# EAGLE schematic lpc176x (EAGLE 7.2.0)
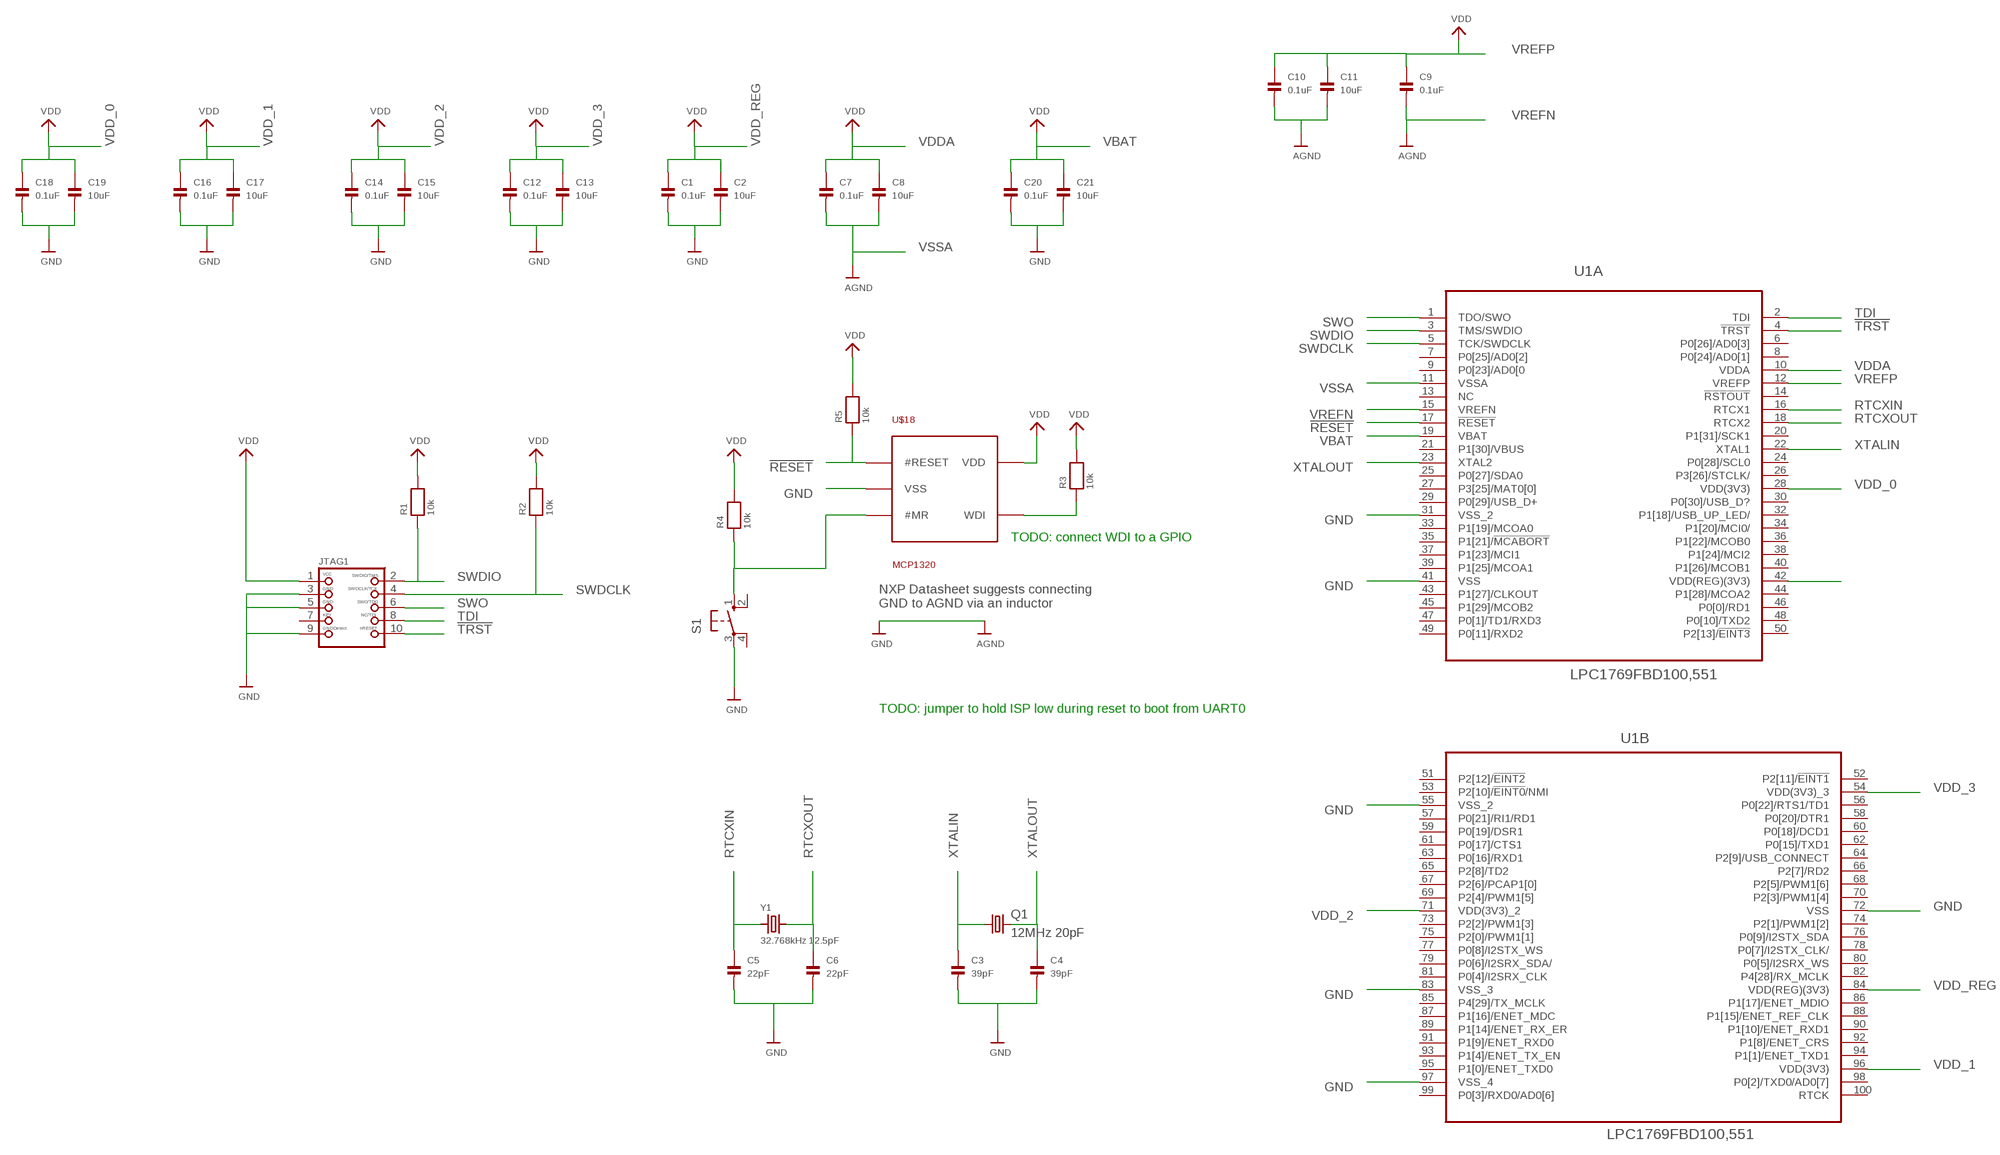
[diagram p0: schematic, sheet 1]

## Parts
C1  0.1uF  CAP_CERAMIC0805  [0805]
C2  10uF  CAP_CERAMIC0805  [0805]
C3  39pF  CAP_CERAMIC0805  [0805]
C4  39pF  CAP_CERAMIC0805  [0805]
C5  22pF  CAP_CERAMIC0805  [0805]
C6  22pF  CAP_CERAMIC0805  [0805]
C7  0.1uF  CAP_CERAMIC0805  [0805]
C8  10uF  CAP_CERAMIC0805  [0805]
C9  0.1uF  CAP_CERAMIC0805  [0805]
C10  0.1uF  CAP_CERAMIC0805  [0805]
C11  10uF  CAP_CERAMIC0805  [0805]
C12  0.1uF  CAP_CERAMIC0805  [0805]
C13  10uF  CAP_CERAMIC0805  [0805]
C14  0.1uF  CAP_CERAMIC0805  [0805]
C15  10uF  CAP_CERAMIC0805  [0805]
C16  0.1uF  CAP_CERAMIC0805  [0805]
C17  10uF  CAP_CERAMIC0805  [0805]
C18  0.1uF  CAP_CERAMIC0805  [0805]
C19  10uF  CAP_CERAMIC0805  [0805]
C20  0.1uF  CAP_CERAMIC0805  [0805]
C21  10uF  CAP_CERAMIC0805  [0805]
JTAG1  JTAG-CORTEXM3  [2X05_1.27MM_SMT]
Q1  12MHz 20pF  CRYSTALHC49S  [HC49/S]
R1  10k  RESISTOR0805  [0805]
R2  10k  RESISTOR0805  [0805]
R3  10k  RESISTOR0805  [0805]
R4  10k  RESISTOR0805  [0805]
R5  10k  RESISTOR0805  [0805]
S1  10-XX  [B3F-10XX]
U1  LPC1769FBD100,551  [QFP50P1600X1600X160-100N]
U$18  MCP1320  [SOT-23-5]
Y1  32.768kHz 12.5pF  CRYSTAL8X3.8SMT  [CRYSTAL_8X3.8]

## Nets
!RESET: R5.1 U1.17(A:!RESET) U$18.P1(#RESET)
!TRST: JTAG1.10 U1.4(A:!TRST)
AGND: C10.2 C11.2
GND: C1.2 C2.2 C3.2 C4.2 C5.2 C6.2 C12.2 C13.2 C14.2 C15.2 C16.2 C17.2 C18.2 C19.2 C20.2 C21.2 JTAG1.3 JTAG1.5 JTAG1.9 S1.3(P) U1.31(A:VSS_2) U1.41(A:VSS) U1.55(B:VSS_2) U1.72(B:VSS) U1.83(B:VSS_3) U1.97(B:VSS_4) U$18.P2(VSS) ; supply symbol labelled AGND
N$1: U1.42(A:VDD(REG)(3V3))
N$3: R3.1 U$18.P4(WDI)
N$7: R4.1 S1.1(S) U$18.P3(#MR)
RTCXIN: C5.1 U1.16(A:RTCX1) Y1.P$1
RTCXOUT: C6.1 U1.18(A:RTCX2) Y1.P$4
SWDCLK: JTAG1.4 R2.1 U1.5(A:TCK/SWDCLK)
SWDIO: JTAG1.2 R1.1 U1.3(A:TMS/SWDIO)
SWO: JTAG1.6 U1.1(A:TDO/SWO)
TDI: JTAG1.8 U1.2(A:TDI)
VBAT: C20.1 C21.1 U1.19(A:VBAT) ; supply symbol labelled VDD
VDD: JTAG1.1 R1.2 R2.2 R3.2 R4.2 R5.2 U$18.P5(VDD)
VDD_0: C18.1 C19.1 U1.28(A:VDD(3V3)) ; supply symbol labelled VDD
VDD_1: C16.1 C17.1 U1.96(B:VDD(3V3)) ; supply symbol labelled VDD
VDD_2: C14.1 C15.1 U1.71(B:VDD(3V3)_2) ; supply symbol labelled VDD
VDD_3: C12.1 C13.1 U1.54(B:VDD(3V3)_3) ; supply symbol labelled VDD
VDD_REG: C1.1 C2.1 U1.84(B:VDD(REG)(3V3)) ; supply symbol labelled VDD
VDDA: C7.1 C8.1 U1.10(A:VDDA) ; supply symbol labelled VDD
VREFN: C9.2 U1.15(A:VREFN) ; supply symbol labelled AGND
VREFP: C9.1 C10.1 C11.1 U1.12(A:VREFP) ; supply symbol labelled VDD
VSSA: C7.2 C8.2 U1.11(A:VSSA) ; supply symbol labelled AGND
XTALIN: C3.1 Q1.1 U1.22(A:XTAL1)
XTALOUT: C4.1 Q1.2 U1.23(A:XTAL2)
Unconnected: JTAG1.7 S1.2(S1) S1.4(P1) U1.6(A:P0[26]/AD0[3]) U1.7(A:P0[25]/AD0[2]) U1.8(A:P0[24]/AD0[1]) U1.9(A:P0[23]/AD0[0) U1.13(A:NC) U1.14(A:!RSTOUT) U1.20(A:P1[31]/SCK1) U1.21(A:P1[30]/VBUS) U1.24(A:P0[28]/SCL0) U1.25(A:P0[27]/SDA0) U1.26(A:P3[26]/STCLK/) U1.27(A:P3[25]/MAT0[0]) U1.29(A:P0[29]/USB_D+) U1.30(A:P0[30]/USB_D?) U1.32(A:P1[18]/USB_UP_LED/) U1.33(A:P1[19]/MCOA0) U1.34(A:P1[20]/MCI0/) U1.35(A:P1[21]/!MCABORT!) U1.36(A:P1[22]/MCOB0) U1.37(A:P1[23]/MCI1) U1.38(A:P1[24]/MCI2) U1.39(A:P1[25]/MCOA1) U1.40(A:P1[26]/MCOB1) U1.43(A:P1[27]/CLKOUT) U1.44(A:P1[28]/MCOA2) U1.45(A:P1[29]/MCOB2) U1.46(A:P0[0]/RD1) U1.47(A:P0[1]/TD1/RXD3) U1.48(A:P0[10]/TXD2) U1.49(A:P0[11]/RXD2) U1.50(A:P2[13]/!EINT3!) U1.51(B:P2[12]/!EINT2!) U1.52(B:P2[11]/!EINT1!) U1.53(B:P2[10]/!EINT0!/NMI) U1.56(B:P0[22]/RTS1/TD1) U1.57(B:P0[21]/RI1/RD1) U1.58(B:P0[20]/DTR1) U1.59(B:P0[19]/DSR1) U1.60(B:P0[18]/DCD1) U1.61(B:P0[17]/CTS1) U1.62(B:P0[15]/TXD1) U1.63(B:P0[16]/RXD1) U1.64(B:P2[9]/USB_CONNECT) U1.65(B:P2[8]/TD2) U1.66(B:P2[7]/RD2) U1.67(B:P2[6]/PCAP1[0]) U1.68(B:P2[5]/PWM1[6]) U1.69(B:P2[4]/PWM1[5]) U1.70(B:P2[3]/PWM1[4]) U1.73(B:P2[2]/PWM1[3]) U1.74(B:P2[1]/PWM1[2]) U1.75(B:P2[0]/PWM1[1]) U1.76(B:P0[9]/I2STX_SDA) U1.77(B:P0[8]/I2STX_WS) U1.78(B:P0[7]/I2STX_CLK/) U1.79(B:P0[6]/I2SRX_SDA/) U1.80(B:P0[5]/I2SRX_WS) U1.81(B:P0[4]/I2SRX_CLK) U1.82(B:P4[28]/RX_MCLK) U1.85(B:P4[29]/TX_MCLK) U1.86(B:P1[17]/ENET_MDIO) U1.87(B:P1[16]/ENET_MDC) U1.88(B:P1[15]/ENET_REF_CLK) U1.89(B:P1[14]/ENET_RX_ER) U1.90(B:P1[10]/ENET_RXD1) U1.91(B:P1[9]/ENET_RXD0) U1.92(B:P1[8]/ENET_CRS) U1.93(B:P1[4]/ENET_TX_EN) U1.94(B:P1[1]/ENET_TXD1) U1.95(B:P1[0]/ENET_TXD0) U1.98(B:P0[2]/TXD0/AD0[7]) U1.99(B:P0[3]/RXD0/AD0[6]) U1.100(B:RTCK)

## Notes on the sheet
- TODO: connect WDI to a GPIO
- NXP Datasheet suggests connecting
  GND to AGND via an inductor
- TODO: jumper to hold ISP low during reset to boot from UART0

## Library data of the parts
C1-C21 = microbuilder:CAP_CERAMIC: Ceramic Capacitors 0402 - 0402 Surface Mount Capacitors 16pF 50V 5% [Digikey: 445-4899-2-ND] 18pF 50V 5% [Digikey: 490-1281-2-ND] 22pF 50V 5% [Digikey: 490-1283-2-ND] 68pF 50V 5% [Digikey: 490-1289-2-ND] 0.1uF 10V 10% [Digikey: 490-1318-2-ND] 1.0uF 6.3V 10% [Digikey: 490-1320-2-ND] 0603 - 0603 Surface Mount Capacitors 16 pF 50V 5% [Digikey: 445-5051-2-ND] 22 pF 50V [Digikey: PCC220ACVTR-ND] 33 pF 50V 5% [Digikey: 490-1415-1-ND] 56pF 50V 5% [Digikey: 490-1421-1-ND] 220pF 50V 5% [Digikey: 445-1285-1-ND] 680 pF 50V 2200 pF 50V 5% C0G [Digikey: 445-1297-1-ND] 5600 pF 100V 5% X7R [Digikey: 478-3711-1-ND] 0.1 µF 25V 10% [Digikey: PCC2277TR-ND] 0.22 µF 16V 10% X7R [Digikey: 445-1318-1-ND] 1.0 µF 25V 10% [Digikey: 445-5146-2-ND] 0603 - RF Specific 3pF 250V +/-0.1pF RF [Digikey: 712-1347-1-ND] 18 pF 250V 5% [Digikey: 478-3505-1-ND or 712-1322-1-ND] 56 pF 250V 5% C0G RF [Digikey: 490-4867-1-ND] 68 pF 250V RF [Digikey: 490-4868-1-ND] 0805 - 0805 Surface Mount Capacitors 220 pF 250V 2% RF Ceramic Capacitor [Digikey: 712-1398-1-ND] 1000 pF 50V 2% NP0 Ceramic Capacitor [Digikey: 478-3760-1-ND] 0.1 µF 25V 10% Ceramic Capacitor [Digikey: PCC1828TR-ND] 1.0 µF 16V 10% Ceramic Capacitor[Digikey: 490-1691-2-ND] 10.0 µF 10V 10% Ceramic Capacitor[Digikey: 709-1228-1-ND] 10.0 uF 16V 10% Ceramic Capacitor [Digikey: 478-5165-2-ND] 47 uF 6.3V 20% Ceramic Capacitor [Digikey: 587-1779-1-ND or 399-5506-1-ND] 1206 - 1206 Surface Mount Capacitors 47uF 10V 20% Ceramic Capacitor [Digikey: 490-5528-1-ND or 399-5508-1-ND or 445-6010-1-ND] 100uF 6.3V -20%, +80% Y5V Ceramic Capacitor (Digikey: 490-4512-1-ND, Mouser: 81-GRM31CF50J107ZE1L)
JTAG1 = microbuilder:JTAG-CORTEXM3: Serial Wire (SW-DP) Connector This standard 0.05" 10-pin connector is for use with the Cortex M0/M3's native SWD (serial wire debugger) interface (SW-DP). Some boards support a 20-pin combined JTAG+SWD connector (SWJ-DP), such as the LPC1700 family, but many smaller devices only work with SWD which typically use the smaller 10-pin SW-DP connecter (the LPC1300 family, for example, only supports SWD). 2x05 1.27mm/0.05" Connector: This is the standard SMT connector defined by ARM for all Cortex devices, and should be used in most situations and for forward-compatibility since any new devices coming to market will likely use this connector. MOLEX 10 Pin 0.1" Connector: This 0.1" 10 pin connector has the same pin layout as the standard 0.05" connector, but is easier to work with if you are using standard jumper wires or custom cables to connect your SWD hardware. MOLEX 20 Pin 0.1" Connector: This 0.1" 20 pin connector is the same model used for ARM7/ARM9 JTAG debuggers, but is connected to match the pins on the Segger J-Link for ARM (which supports both JTAG and SWD debugging). See the following document from ARM for more information on Cortex M3 Debug Connectors: http://infocenter.arm.com/help/topic/com.arm.doc.faqs/attached/13634/cortex_debug_connectors.pdf And the following page for an overview with images of the different connector types: http://www.keil.com/peripherals/coresight/connectors.asp
Q1 = adafruit:CRYSTAL: CRYSTAL; OC_FARNELL: 1667008; OC_NEWARK: unknown
R1-R5 = microbuilder:RESISTOR: Resistors 0402 - 0402 Surface Mount Package 22 Ohm 1% 1/16W [Digikey: 311-22.0LRTR-ND] 33 Ohm 5% 1/16W 1.0K 5% 1/16W 1.5K 5% 1/16W 2.0K 1% 1/16W 10.0K 1% 1/16W [Digikey: 311-10.0KLRTR-ND] 10.0K 5% 1/16W [Digikey: RMCF0402JT10K0TR-ND] 12.1K 1% 1/16W [Digikey: 311-22.0LRTR-ND] 100.0K 5% 1/16W 0603 - 0603 Surface Mount Package 0 Ohm 1/10 Watt 1% Resistor 15 Ohm 1/10 Watt 1% Resistor 33 Ohm 1/10 Watt 1% Resistor 49.9 Ohm 1/10 Watt 1% Resistor 100 Ohm 1/10 Watt 1% Resistor 150 Ohm 1/10 Watt 1% Resistor 240 Ohm 1/10 Watt 1% Resistor 390 Ohm 1/10 Watt 1% Resistor 560 Ohm 1/10 Watt 1% Resistor 680 Ohm 1/10 Watt 1% Resistor 750 Ohm 1/10 Watt 1% Resistor 1.0K Ohm 1/10 Watt 1% Resistor 1.5K Ohm 1/10 Watt 1% Resistor 2.0K Ohm 1/10 Watt 1% Resistor 2.2K Ohm 1/10 Watt 1% Resistor 3.3K Ohm 1/10 Watt 1% Resistor 4.7K Ohm 1/10 Watt 1% Resistor 10.0K Ohm 1/10 Watt 1% Resistor 12.0K Ohm 1/10 Watt 1% Resistor 12.1K Ohm 1/10 Watt 1% Resistor 20.0K Ohm 1/10 Watt 1% Resistor 33.0K Ohm 1/10 Watt 1% Resistor 100.0K Ohm 1/10 Watt 1% Resistor 0805 - 0805 Surface Mount Package 0 Ohm 1/8 Watt 1% Resistor 33 Ohm 1/8 Watt 1% Resistor 100 Ohm 1/8 Watt 1% Resistor 150 Ohm 1/8 Watt 1% Resistor 200 Ohm 1/8 Watt 1% Resistor 240 Ohm 1/8 Watt 1% Resistor 330 Ohm 1/8 Watt 1% Resistor 390 Ohm 1/8 Watt 1% Resistor 470 Ohm 1/8 Watt 1% Resistor 1.0K Ohm 1/8 Watt 1% Resistor 1.5K Ohm 1/8 Watt 1% Resistor 2.0K Ohm 1/8 Watt 1% Resistor 4.7K Ohm 1/8 Watt 1% Resistor 5.1K Ohm 1/8 Watt 1% Resistor 5.6K Ohm 1/8 Watt 1% Resistor 10.0K Ohm 1/8 Watt 1% Resistor 22.0K Ohm 1/8 Watt 1% Resistor 33.0K Ohm 1/8 Watt 1% Resistor 100K Ohm 1/8 Watt 1% Resistor 1206 - 1206 Surface Mount Package 2012 - 2010 Surface Mount Package 0.11 Ohm 1/2 Watt 1% Resistor - Digikey: RHM.11UCT-ND
S1 = switch-omron:10-XX: OMRON SWITCH; MPN: B3F-1000; OC_FARNELL: 176432; OC_NEWARK: 36M3542
U1 = lpc176x:LPC1769FBD100,551: IC, 32-bit ARM Cortex-M3 microcontroller, 100LQFP; MPN: LPC1769FBD100,551; OC_FARNELL: 2072199; OC_NEWARK: 70R5603; PACKAGE: LQFP100; SUPPLIER: NXP
U$18 = flight controller:MCP1320
Y1 = microbuilder:CRYSTAL: Crystals HC49UP - Surface Mount Crystal 4.0MHz 18pF +/-30ppm Surface Mount Crystal [Digikey: 535-9857-1-ND] 12.0 MHz Surface Mount Crystal [Digikey: 535-9869-6-ND] 25.0 MHz Surface Mount Crystal [Digikey: 535-9078-1-ND] 2.5 x 2.0mm - MEMs SMT Crystal 16.0 MHz 10pF 20ppm 2.5 x 2.0mm Crystal [Digikey -40-85°C: 535-10923-1-ND] 3.2 x 2.5mm - MEMs SMT Crystal 12.0 MHz 8pF 15ppm 3.2 x 2.5mm Crystal [Digikey: -10-70°C: 644-1047-1-ND -40-125°C: 644-1128-1-ND] 16.0 MHz 8pF 15ppm 3.2 x 2.5mm Crystal [Digikey: -10-70°C: 644-1049-1-ND -40-125°C: 644-1129-2-ND] 16.0 MHz 10pF 10ppm 3.2 x 2.5mm Crystal [Digikey: 644-1100-1-ND] 27.12 MHz 18pF 30ppm 3.2 x 2.5mm Crystal [Digikey: 887-1424-1-ND] 27.12MHz 10pF 10ppm 3.2 x 2.5mm Crystal [Digikey: 887-1329-1-ND] 4.9 x 1.8mm - MEMs SMT Crystal 32.768 KHz 12.5pF 20ppm 4.9 x 1.8mm Crystal [Digikey: SE2415CT-ND] 8.0 x 3.8mm - Surface Mount Crystal 32.768kHz 12.5pF 20ppm -40°C-85°C [Digikey: 535-9166-2-ND] Cylinder 32.768KHz Cylinder Crystal (2x6mm body) [Ex. Digikey: 300-8341-2-ND]